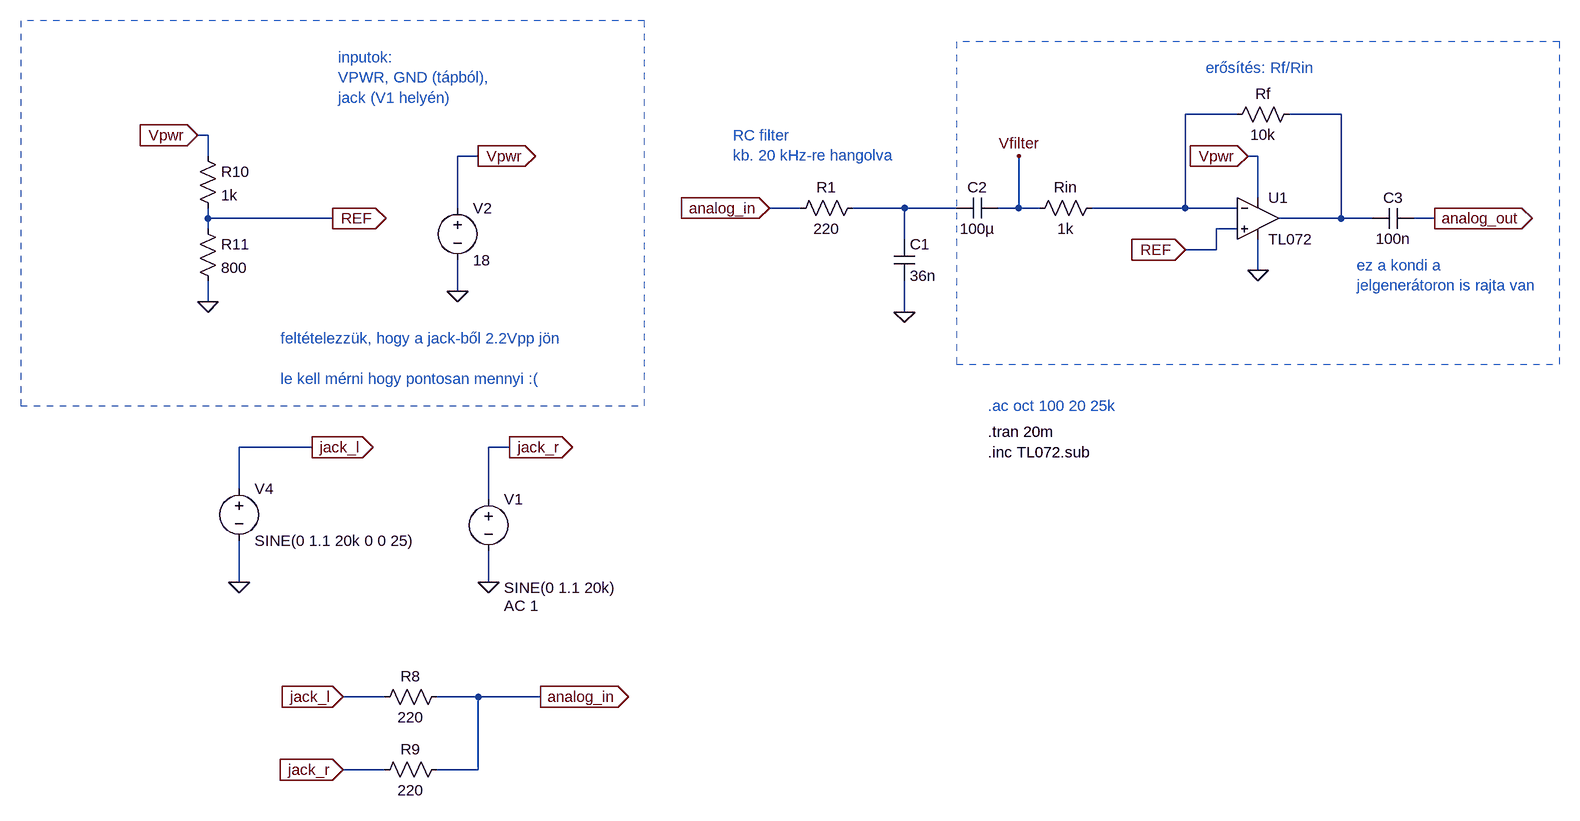
[diagram p0: schematic analog_interface.asc]
analog_interface.asc, the LTspice schematic file:
Version 4.1
SHEET 1 1680 1012
WIRE 896 -112 816 -112
WIRE 1056 -112 976 -112
WIRE -688 -80 -704 -80
WIRE -688 -48 -688 -80
WIRE -272 -48 -304 -48
WIRE 928 -48 912 -48
WIRE 928 16 928 -48
WIRE -304 32 -304 -48
WIRE 224 32 176 32
WIRE 384 32 304 32
WIRE 464 32 384 32
WIRE 560 32 560 -48
WIRE 560 32 528 32
WIRE 592 32 560 32
WIRE 816 32 816 -112
WIRE 816 32 672 32
WIRE 896 32 816 32
WIRE -688 48 -688 32
WIRE -496 48 -688 48
WIRE 1056 48 1056 -112
WIRE 1056 48 960 48
WIRE 1104 48 1056 48
WIRE 1200 48 1168 48
WIRE -688 64 -688 48
WIRE 896 64 864 64
WIRE 384 80 384 32
WIRE 864 96 864 64
WIRE 864 96 816 96
WIRE 928 128 928 80
WIRE -304 160 -304 112
WIRE -688 176 -688 144
WIRE 384 192 384 144
WIRE -528 400 -640 400
WIRE -224 400 -256 400
WIRE -640 464 -640 400
WIRE -256 480 -256 400
WIRE -640 608 -640 544
WIRE -256 608 -256 560
WIRE -416 784 -480 784
WIRE -272 784 -336 784
WIRE -176 784 -272 784
WIRE -416 896 -480 896
WIRE -272 896 -272 784
WIRE -272 896 -336 896
FLAG 384 192 0
FLAG -304 160 0
FLAG -272 -48 Vpwr
IOPIN -272 -48 Out
FLAG 1200 48 analog_out
IOPIN 1200 48 Out
FLAG 928 128 0
FLAG 912 -48 Vpwr
IOPIN 912 -48 In
FLAG 816 96 REF
IOPIN 816 96 In
FLAG 176 32 analog_in
IOPIN 176 32 In
FLAG -496 48 REF
IOPIN -496 48 Out
FLAG -688 176 0
FLAG -224 400 jack_r
IOPIN -224 400 Out
FLAG -256 608 0
FLAG -640 608 0
FLAG -528 400 jack_l
IOPIN -528 400 Out
FLAG -480 784 jack_l
IOPIN -480 784 In
FLAG -480 896 jack_r
IOPIN -480 896 In
FLAG -176 784 analog_in
IOPIN -176 784 Out
FLAG -704 -80 Vpwr
IOPIN -704 -80 In
FLAG 560 -48 Vfilter
SYMBOL voltage -256 464 R0
WINDOW 3 24 152 Left 2
WINDOW 123 24 180 Left 2
WINDOW 39 0 0 Left 0
SYMATTR Value SINE(0 1.1 20k)
SYMATTR Value2 AC 1
SYMATTR InstName V1
SYMBOL res 320 16 R90
WINDOW 0 0 56 VBottom 2
WINDOW 3 32 56 VTop 2
SYMATTR InstName R1
SYMATTR Value 220
SYMBOL cap 368 80 R0
SYMATTR InstName C1
SYMATTR Value 36n
SYMBOL voltage -304 16 R0
WINDOW 123 0 0 Left 0
WINDOW 39 0 0 Left 0
SYMATTR InstName V2
SYMATTR Value 18
SYMBOL OpAmps\\opamp2 928 -16 R0
SYMATTR InstName U1
SYMATTR Value TL072
SYMBOL res 880 -96 R270
WINDOW 0 32 56 VTop 2
WINDOW 3 0 56 VBottom 2
SYMATTR InstName Rf
SYMATTR Value 10k
SYMBOL cap 528 16 R90
WINDOW 0 0 32 VBottom 2
WINDOW 3 32 32 VTop 2
SYMATTR InstName C2
SYMATTR Value 100µ
SYMBOL res 688 16 R90
WINDOW 0 0 56 VBottom 2
WINDOW 3 32 56 VTop 2
SYMATTR InstName Rin
SYMATTR Value 1k
SYMBOL cap 1168 32 R90
WINDOW 0 0 32 VBottom 2
WINDOW 3 32 32 VTop 2
SYMATTR InstName C3
SYMATTR Value 100n
SYMBOL voltage -640 448 R0
WINDOW 123 0 0 Left 0
WINDOW 39 0 0 Left 0
SYMATTR InstName V4
SYMATTR Value SINE(0 1.1 20k 0 0 25)
SYMBOL res -320 768 R90
WINDOW 0 0 56 VBottom 2
WINDOW 3 32 56 VTop 2
SYMATTR InstName R8
SYMATTR Value 220
SYMBOL res -320 880 R90
WINDOW 0 0 56 VBottom 2
WINDOW 3 32 56 VTop 2
SYMATTR InstName R9
SYMATTR Value 220
SYMBOL res -704 -64 R0
SYMATTR InstName R10
SYMATTR Value 1k
SYMBOL res -704 48 R0
SYMATTR InstName R11
SYMATTR Value 800
TEXT 512 336 Left 2 ;.ac oct 100 20 25k
TEXT 512 376 Left 2 !.tran 20m
TEXT 512 408 Left 2 !.inc TL072.sub
TEXT 120 -80 Left 2 ;RC filter\nkb. 20 kHz-re hangolva
TEXT -488 -200 Left 2 ;inputok:\nVPWR, GND (tápból),\njack (V1 helyén)
TEXT 848 -184 Left 2 ;erősítés: Rf/Rin
TEXT -576 232 Left 2 ;feltételezzük, hogy a jack-ből 2.2Vpp jön\n \nle kell mérni hogy pontosan mennyi :(
TEXT 1080 120 Left 2 ;ez a kondi a\njelgenerátoron is rajta van
RECTANGLE Normal 1392 -224 464 272 2
RECTANGLE Normal -976 336 -16 -256 2

The netlist it stands for:
* analog_interface.asc
V1 jack_r 0 SINE(0 1.1 20k) AC 1
R1 N003 analog_in 220
C1 N003 0 36n
V2 Vpwr 0 18
X§U1 REF N001 Vpwr 0 N002 TL072  ; pins In+ In- V+ V- OUT
Rf N001 N002 10k
C2 Vfilter N003 100µ
Rin N001 Vfilter 1k
C3 analog_out N002 100n
V4 jack_l 0 SINE(0 1.1 20k 0 0 25)
R8 analog_in jack_l 220
R9 analog_in jack_r 220
R10 Vpwr REF 1k
R11 REF 0 800
* .ac oct 100 20 25k
.tran 20m
.inc TL072.sub
* RC filter
* kb. 20 kHz-re hangolva
* inputok:
* VPWR, GND (tápból),
* jack (V1 helyén)
* erősítés: Rf/Rin
* feltételezzük, hogy a jack-ből 2.2Vpp jön
* le kell mérni hogy pontosan mennyi :(
* ez a kondi a
* jelgenerátoron is rajta van
.backanno
.end